# Altium schematic sheet Shutdown_Converter.SchDoc: Shutdown Circuit Indicator
size A4; CheckedBy: Nico Bieberich; Author: Nico Bieberich; Organization: Baltic Racing; Address1: Zur Schwedenschanze 15; Address2: Haus 18; Address3: 18435 Stralsund; Revision: xx.xx; SheetNumber: X; SheetTotal: X; Rules: LVS; ProjectName: Projekt
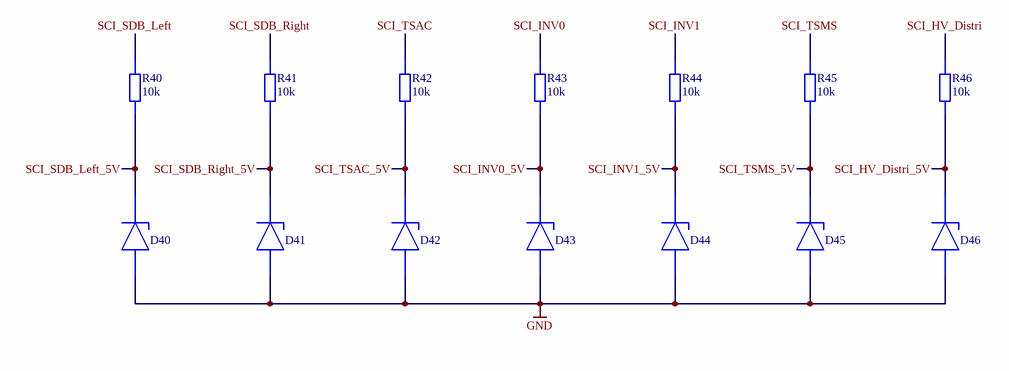
[diagram p0: Shutdown_Converter.SchDoc]

## Parts
D40  MM3Z4V7T1G  [SOD-323-2]  (value not drawn)
D41  MM3Z4V7T1G  [SOD-323-2]  (value not drawn)
D42  MM3Z4V7T1G  [SOD-323-2]  (value not drawn)
D43  MM3Z4V7T1G  [SOD-323-2]  (value not drawn)
D44  MM3Z4V7T1G  [SOD-323-2]  (value not drawn)
D45  MM3Z4V7T1G  [SOD-323-2]  (value not drawn)
D46  MM3Z4V7T1G  [SOD-323-2]  (value not drawn)
R40  value 10k  [STACKPOLE CSR0603]  (hidden comment: SMD Resistor)
R41  value 10k  [STACKPOLE CSR0603]  (hidden comment: SMD Resistor)
R42  value 10k  [STACKPOLE CSR0603]  (hidden comment: SMD Resistor)
R43  value 10k  [STACKPOLE CSR0603]  (hidden comment: SMD Resistor)
R44  value 10k  [STACKPOLE CSR0603]  (hidden comment: SMD Resistor)
R45  value 10k  [STACKPOLE CSR0603]  (hidden comment: SMD Resistor)
R46  value 10k  [STACKPOLE CSR0603]  (hidden comment: SMD Resistor)

## Nets
GND: D40.2A(A) D41.2A(A) D42.2A(A) D43.2A(A) D44.2A(A) D45.2A(A) D46.2A(A)
SCI_HV_Distri: R46.2
SCI_HV_Distri_5V: D46.1C(C) R46.1
SCI_INV0: R43.2
SCI_INV0_5V: D43.1C(C) R43.1
SCI_INV1: R44.2
SCI_INV1_5V: D44.1C(C) R44.1
SCI_SDB_Left: R40.2
SCI_SDB_Left_5V: D40.1C(C) R40.1
SCI_SDB_Right: R41.2
SCI_SDB_Right_5V: D41.1C(C) R41.1
SCI_TSAC: R42.2
SCI_TSAC_5V: D42.1C(C) R42.1
SCI_TSMS: R45.2
SCI_TSMS_5V: D45.1C(C) R45.1

## Notes on the sheet
- Title:
- Projekt:
- Revision:
- Author:
- Rules:
- Checked by:
- Sheet
- of
- Size:
- A4
- Date:
- Time:

## Library data of the parts
D40-D46 = MM3Z4V7T1G: onsemi MM3Z4V7T1G / Z-Diode, 4,7V; ComponentLink1Description: Octopart; ComponentLink1URL: https://octopart.com/mm3z4v7t1g-onsemi-331144?r=sp
R40-R46 = SMD Resistor: Resistor with multiple footprints